# EAGLE design BeeBeeAte-RemoteBoard (EAGLE 9.6.2)

## Sheet 1 of 3: ESP-32 mit USB Schnitstelle und Joystick
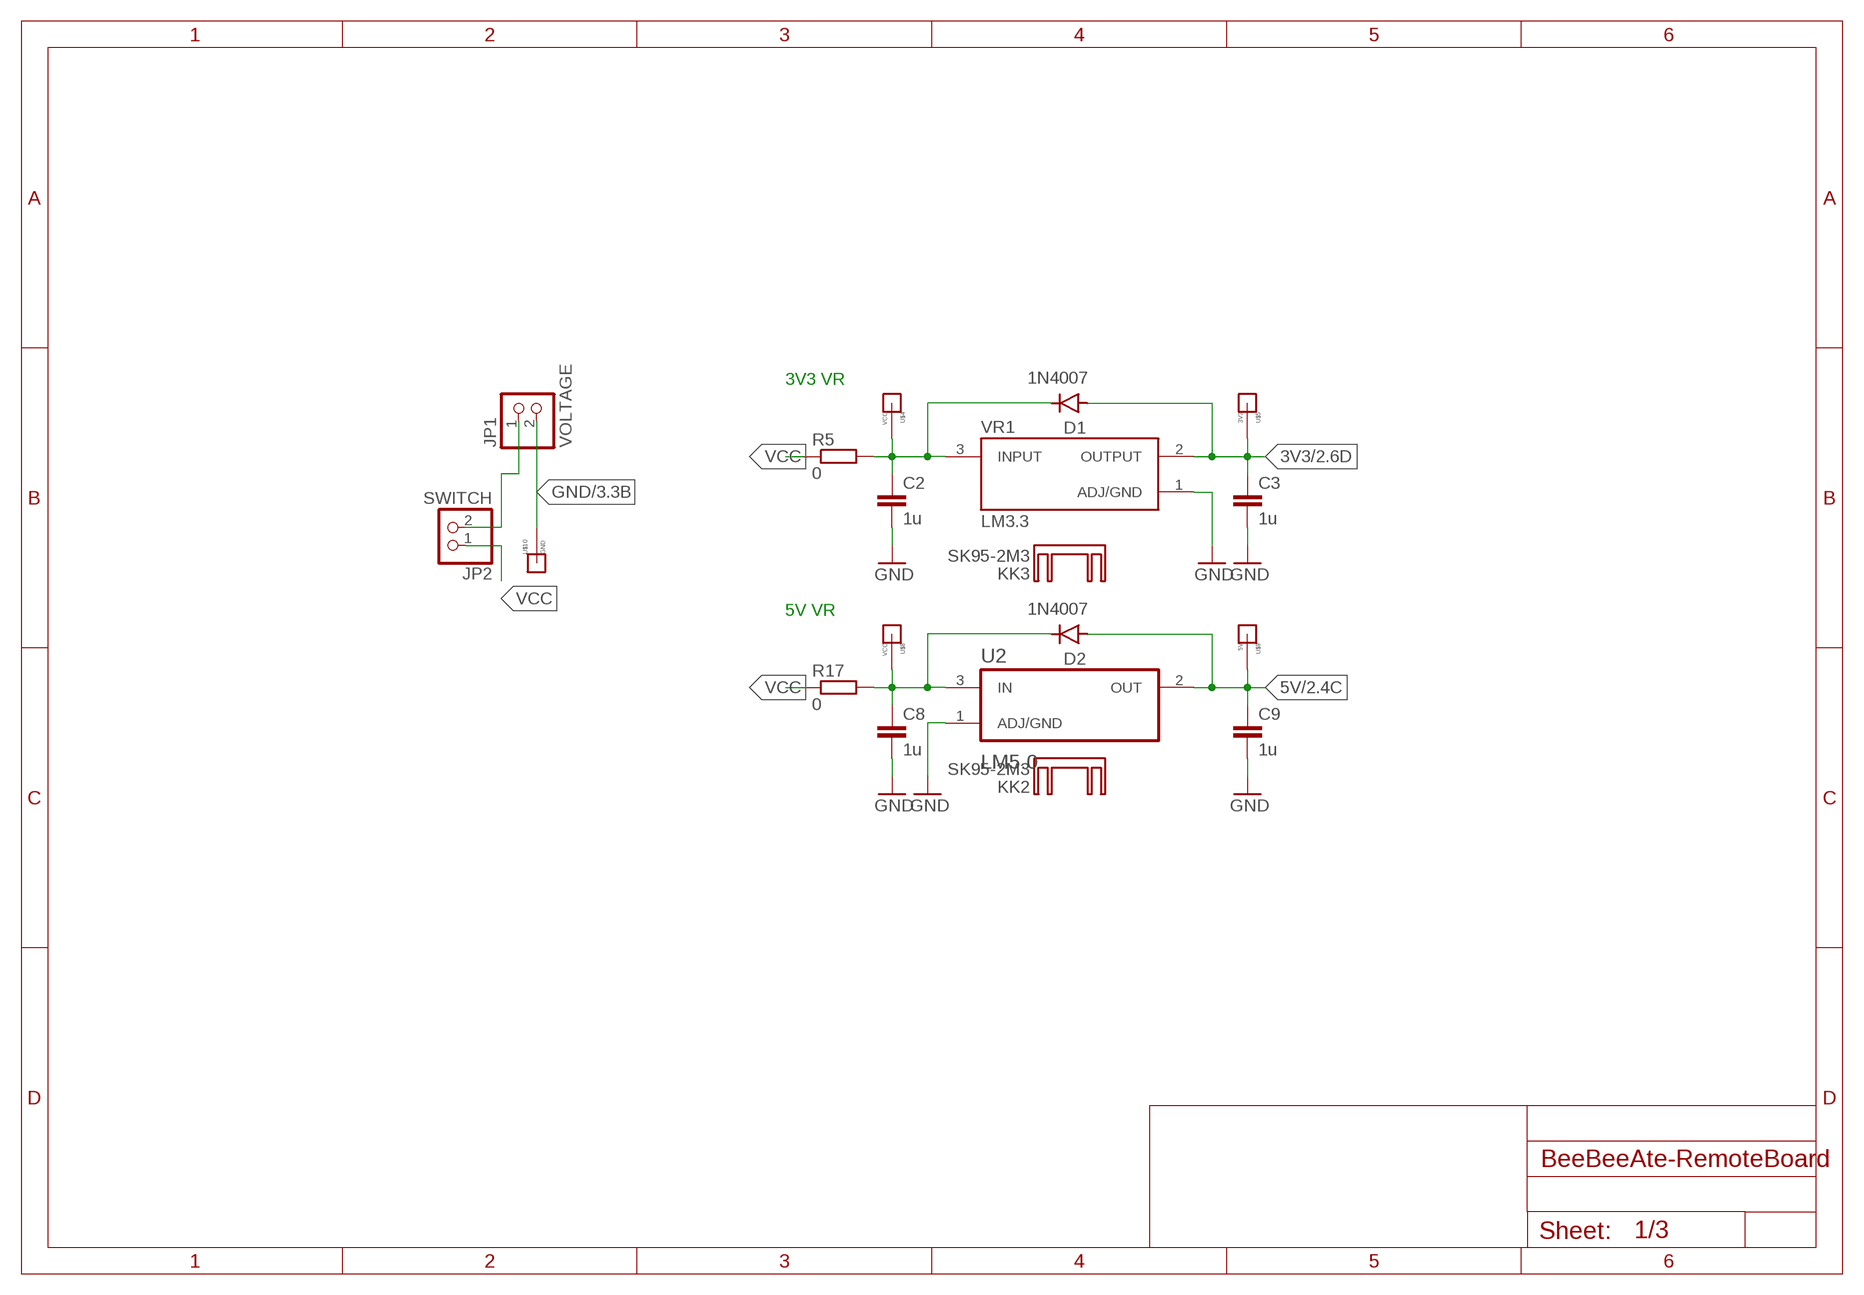
[diagram p0: schematic, sheet 1]

### Parts
C2  1u  C-EUC0805  [C0805]
C3  1u  C-EUC0805  [C0805]
C8  1u  C-EUC0805  [C0805]
C9  1u  C-EUC0805  [C0805]
D1  1N4007  [DO-41]
D2  1N4007  [DO-41]
JP1  VOLTAGE  PINHD-1X2  [1X02]
JP2  SWITCH  PINHD-1X2  [1X02]
KK2  SK95-2M3  [SK95-2M3]
KK3  SK95-2M3  [SK95-2M3]
R5  0  R-EU_R0805  [R0805]
R17  0  R-EU_R0805  [R0805]
U2  LM5.0  LM1117T-5.0  [TO254P1054X470X1955-3]
U$4  VCC  MESSPAD  [MESSPAD]
U$5  3V3  MESSPAD  [MESSPAD]
U$8  VCC  MESSPAD  [MESSPAD]
U$9  5V  MESSPAD  [MESSPAD]
U$10  GND  MESSPAD  [MESSPAD]
VR1  LM3.3  LM1117T-3.3/NOPB  [TO254P1054X470X1955-3]

### Nets
3V3: C3.1 D1.A U$5.MSP VR1.2(OUTPUT) ; also sheet 2,3
5V: C9.1 D2.A U2.2(OUT) U$9.MSP ; also sheet 2
GND: C2.2 C3.2 C8.2 C9.2 JP1.2 U2.1(ADJ/GND) U$10.MSP VR1.1(ADJ/GND) ; also sheet 2,3
N$3: C8.1 D2.C R17.2 U2.3(IN) U$8.MSP
N$4: C2.1 D1.C R5.2 U$4.MSP VR1.3(INPUT)
N$5: JP1.1 JP2.2
VCC: JP2.1 R5.1 R17.1

### Notes on the sheet
- 3V3 VR
- 5V VR

## Sheet 2 of 3: ESP 32
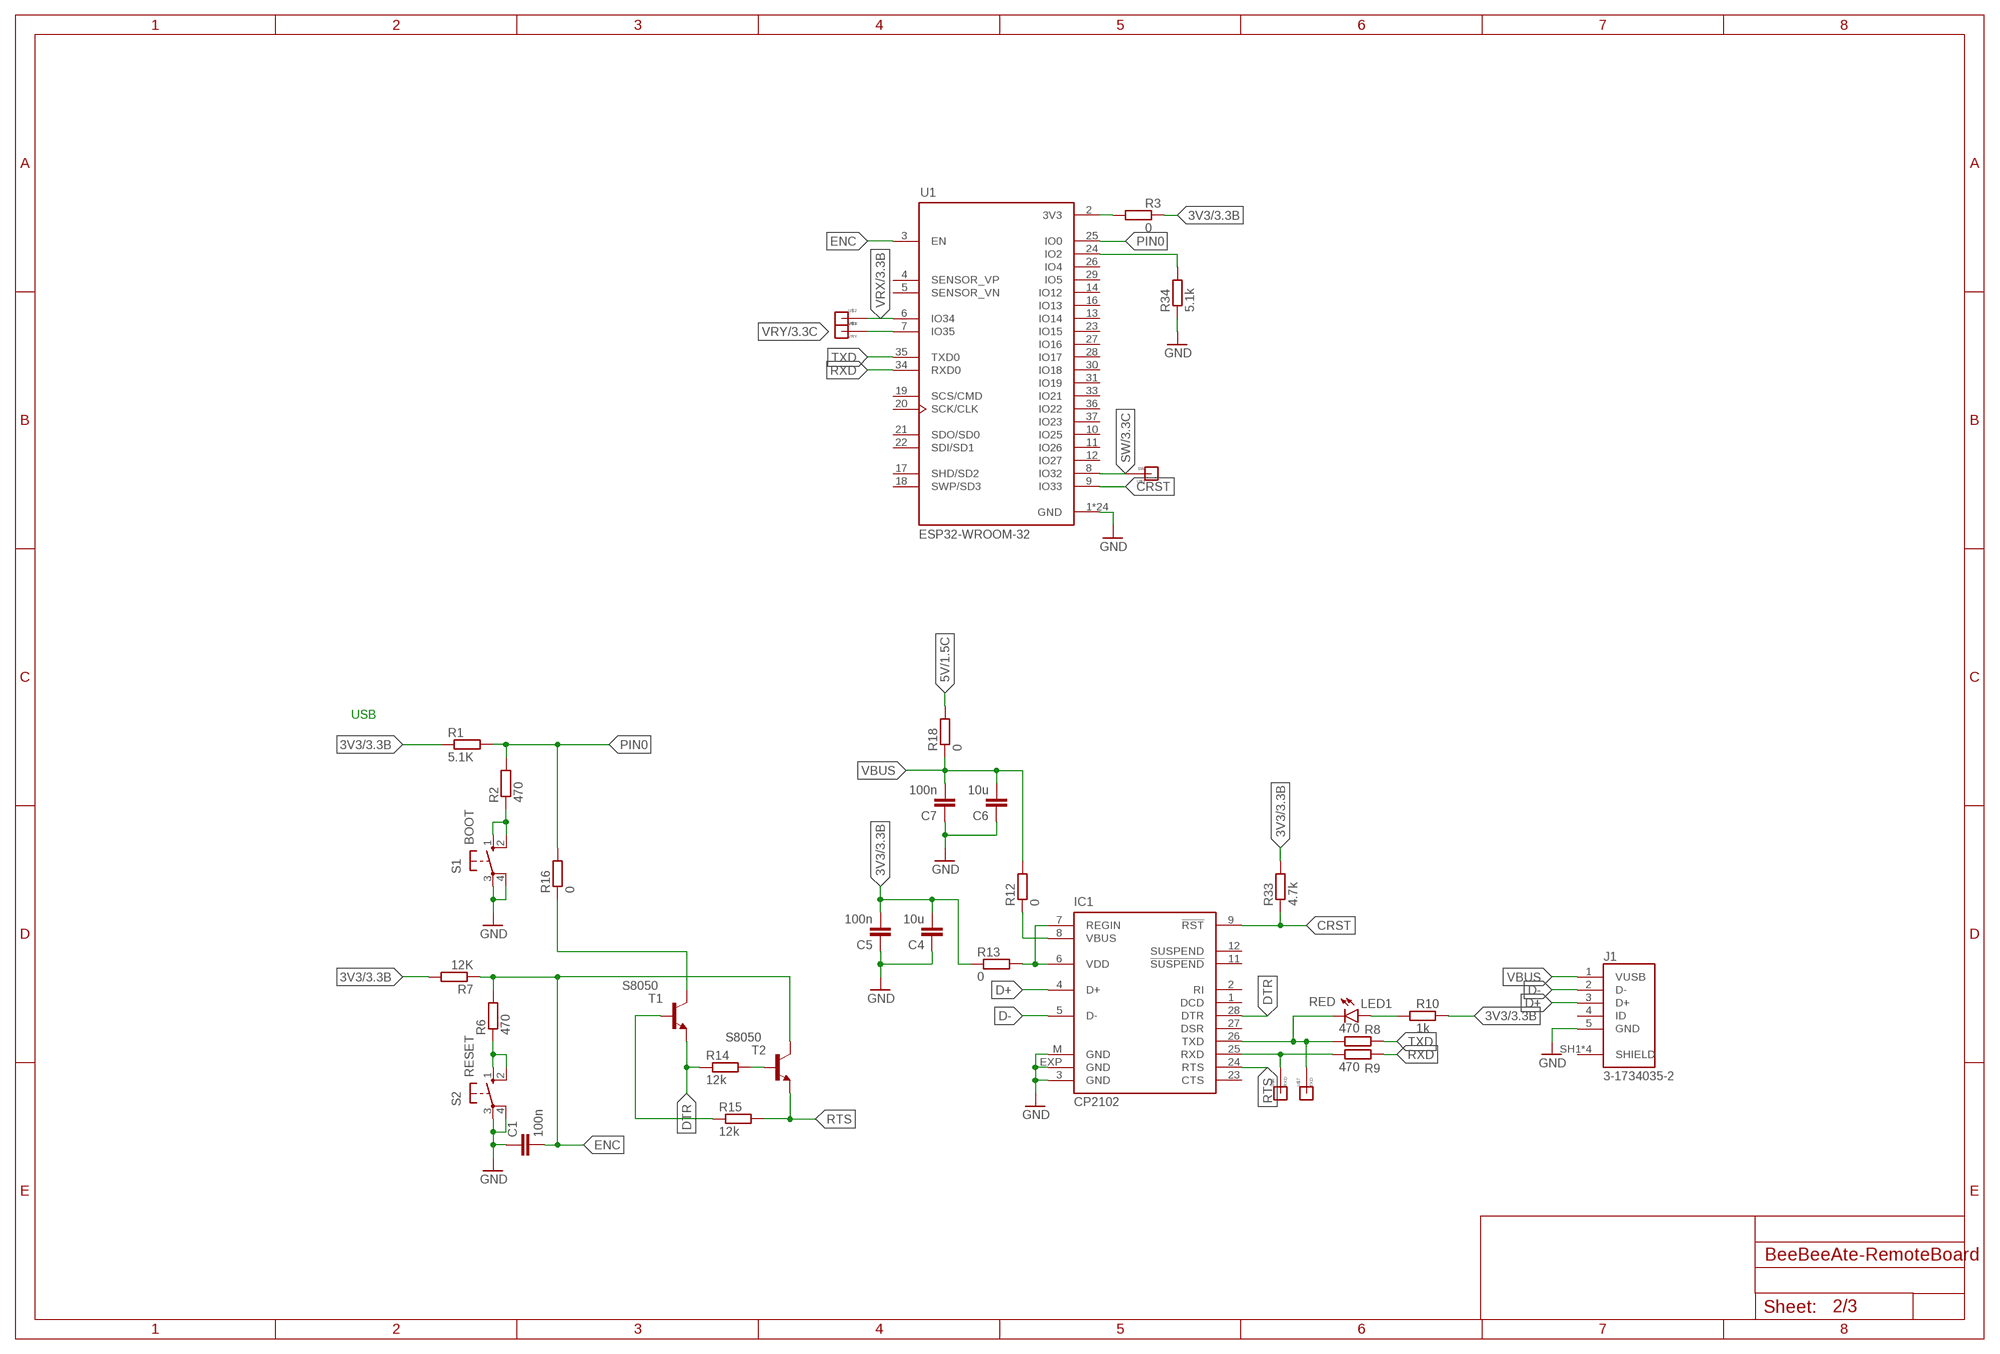
[diagram p1: schematic, sheet 2]

### Parts
C1  100n  C-EUC0805  [C0805]
C4  10u  C-EUC0805  [C0805]
C5  100n  C-EUC0805  [C0805]
C6  10u  C-EUC0805  [C0805]
C7  100n  C-EUC0805  [C0805]
IC1  CP2102  [MLP28]
J1  3-1734035-2  [TE_3-1734035-2]
LED1  RED  LEDCHIP-LED0805  [CHIP-LED0805]
R1  5.1K  R-EU_R0805  [R0805]
R2  470  R-EU_R0805  [R0805]
R3  0  R-EU_R0805  [R0805]
R6  470  R-EU_R0805  [R0805]
R7  12K  R-EU_R0805  [R0805]
R8  470  R-EU_R0805  [R0805]
R9  470  R-EU_R0805  [R0805]
R10  1k  R-EU_R0805  [R0805]
R12  0  R-EU_R0805  [R0805]
R13  0  R-EU_R0805  [R0805]
R14  12k  R-EU_R0805  [R0805]
R15  12k  R-EU_R0805  [R0805]
R16  0  R-EU_R0805  [R0805]
R18  0  R-EU_R0805  [R0805]
R33  4.7k  R-EU_R0805  [R0805]
R34  5.1k  R-EU_R0805  [R0805]
S1  BOOT  10-XX  [B3F-10XX]
S2  RESET  10-XX  [B3F-10XX]
T1  S8050  BC808-NPN-SOT23-BEC  [SOT23-BEC]
T2  S8050  BC808-NPN-SOT23-BEC  [SOT23-BEC]
U1  ESP32-WROOM-32  [MODULE_ESP32-WROOM-32]
U$1  VRY  MESSPAD  [MESSPAD]
U$2  VRX  MESSPAD  [MESSPAD]
U$3  SW  MESSPAD  [MESSPAD]
U$6  RXD  MESSPAD  [MESSPAD]
U$7  TXD  MESSPAD  [MESSPAD]

### Nets
3V3: C4.2 C5.2 R1.1 R3.2 R7.2 R10.2 R13.1 R33.2 ; also sheet 1,3
5V: R18.2 ; also sheet 1
CRST: IC1.9(!RST) R33.1 U1.9(IO33)
D+: IC1.4(D+) J1.3(D+)
D-: IC1.5(D-) J1.2(D-)
DTR: IC1.28(DTR) R14.1 T1.E
ENC: C1.2 R6.2 R7.1 T2.C U1.3(EN)
GND: C1.1 C4.1 C5.1 C6.1 C7.1 IC1.3(GND) IC1.EXP(GND) IC1.M(GND) J1.5(GND) R34.1 S1.3(P) S1.4(P1) S2.3(P) S2.4(P1) U1.1(GND) U1.15(GND) U1.38(GND) U1.39_1(GND) U1.39_2(GND) U1.39_3(GND) U1.39_4(GND) U1.39_5(GND) U1.39_6(GND) U1.39_7(GND) U1.39_8(GND) U1.39_9(GND) U1.39_10(GND) U1.39_11(GND) U1.39_12(GND) U1.39_13(GND) U1.39_14(GND) U1.39_15(GND) U1.39_16(GND) U1.39_17(GND) U1.39_18(GND) U1.39_19(GND) U1.39_20(GND) U1.39_21(GND) ; also sheet 1,3
N$1: R2.1 S1.1(S) S1.2(S1)
N$2: R6.1 S2.1(S) S2.2(S1)
N$6: IC1.25(RXD) R9.1 U$6.MSP
N$7: LED1.A R10.1
N$9: IC1.26(TXD) LED1.C R8.1 U$7.MSP
N$10: IC1.6(VDD) IC1.7(REGIN) R13.2
N$11: IC1.8(VBUS) R12.1
N$12: R14.2 T2.B
N$14: R15.1 T1.B
N$15: R3.1 U1.2(3V3)
N$25: R34.2 U1.24(IO2)
PIN0: R1.2 R2.2 R16.2 U1.25(IO0)
PIN1: R16.1 T1.C
RTS: IC1.24(RTS) R15.2 T2.E
RXD: R9.2 U1.34(RXD0)
SW: U1.8(IO32) U$3.MSP ; also sheet 3
TXD: R8.2 U1.35(TXD0)
VBUS: C6.2 C7.2 J1.1(VUSB) R12.2 R18.1
VRX: U1.6(IO34) U$2.MSP ; also sheet 3
VRY: U1.7(IO35) U$1.MSP ; also sheet 3
Unconnected: IC1.1(DCD) IC1.2(RI) IC1.11(!SUSPEND) IC1.12(SUSPEND) IC1.23(CTS) IC1.27(DSR) J1.4(ID) J1.SH1(SHIELD) J1.SH2(SHIELD) J1.SH3(SHIELD) J1.SH4(SHIELD) U1.4(SENSOR_VP) U1.5(SENSOR_VN) U1.10(IO25) U1.11(IO26) U1.12(IO27) U1.13(IO14) U1.14(IO12) U1.16(IO13) U1.17(SHD/SD2) U1.18(SWP/SD3) U1.19(SCS/CMD) U1.20(SCK/CLK) U1.21(SDO/SD0) U1.22(SDI/SD1) U1.23(IO15) U1.26(IO4) U1.27(IO16) U1.28(IO17) U1.29(IO5) U1.30(IO18) U1.31(IO19) U1.33(IO21) U1.36(IO22) U1.37(IO23)

### Notes on the sheet
- USB

## Sheet 3 of 3: Joystick
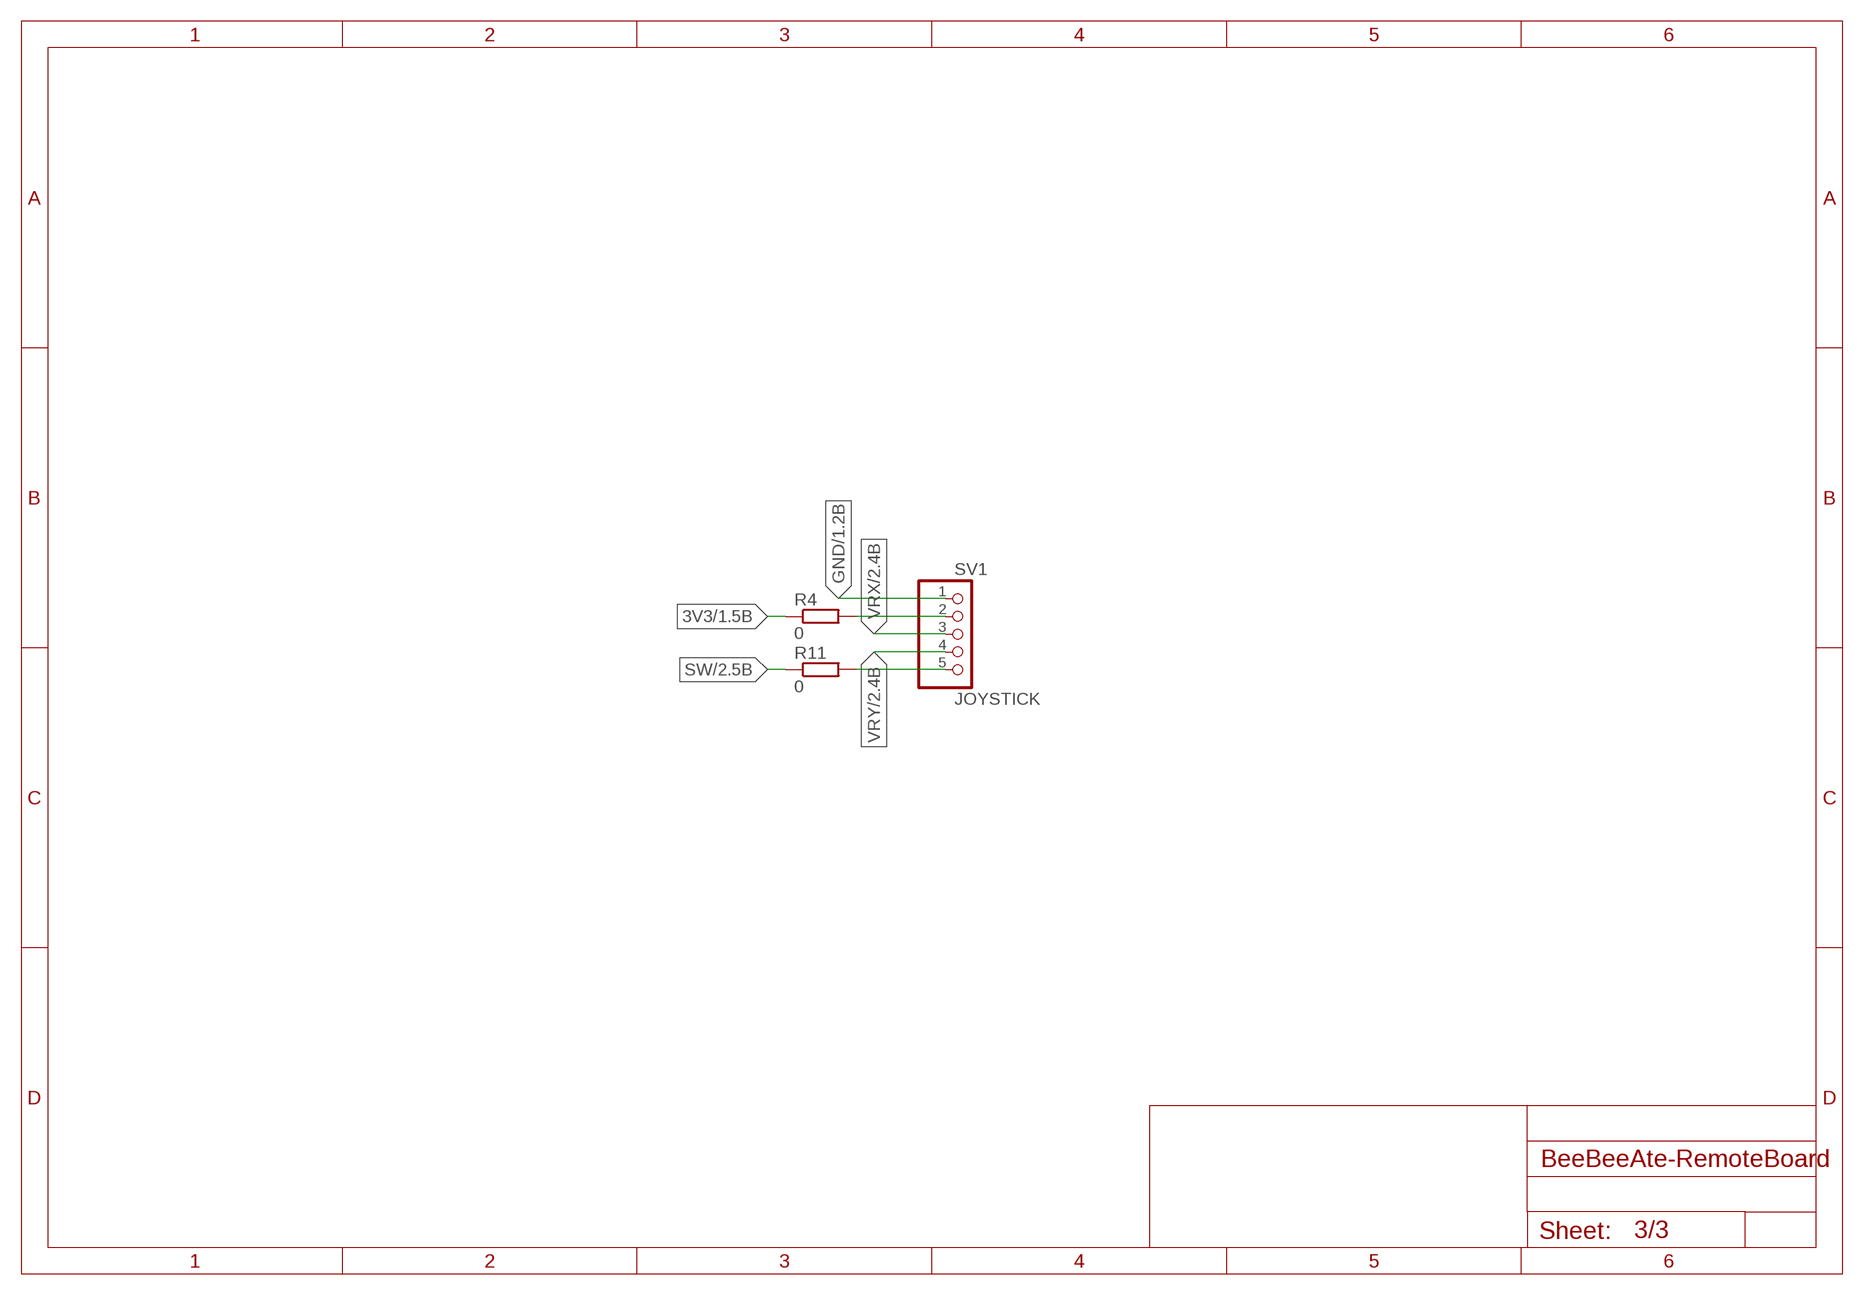
[diagram p2: schematic, sheet 3]

### Parts
R4  0  R-EU_R0805  [R0805]
R11  0  R-EU_R0805  [R0805]
SV1  JOYSTICK  PINHD-1X5/90  [1X05/90]

### Nets
3V3: R4.1 ; also sheet 1,2
GND: SV1.1 ; also sheet 1,2
N$8: R4.2 SV1.2
N$13: R11.2 SV1.5
SW: R11.1 ; also sheet 2
VRX: SV1.3 ; also sheet 2
VRY: SV1.4 ; also sheet 2

## Library data of the parts
C1-C9 = rcl:C-EU: CAPACITOR, European symbol; SPICEPREFIX: C
D1 D2 = Diodes:1N4007: DIODE GEN PURP 1KV 1A DO41 Manufacturer's datasheet <https://www.mccsemi.com/pdf/Products/1N4001-1N4007(DO-41).pdf>; CREATED_BY: PCBLayout.com; DIGIKEY_PART_NUMBER: 1N4007MSCT-ND; MANUFACTURER: Micro Commercial Co; MPN: 1N4007; PACKAGE: DO-41
IC1 = silabs:CP210*: Single-Chip USB to UART Bridge Source: www.silabs.com .. CP2101.pdf / cp2102.pdf; MF: FARNELL; MPN: CP2102-GM; OC_FARNELL: 9282130; OC_NEWARK: 30K5635
J1 = 3-1734035-2:3-1734035-2: USB Connectors MINI USB, R/A, SMT, MATTE TIN, W/O MYLAR Check prices <https://pricing.snapeda.com/parts/3-1734035-2/TE%20Connectivity/view-part?ref=eda>; AVAILABILITY: In Stock; COMMENT: 3-1734035-2; DESCRIPTION: USB Connectors MINI USB, R/A, SMT, MATTE TIN, W/O MYLAR; MF: TE Connectivity; MP: 3-1734035-2; PACKAGE: None; PRICE: None; PURCHASE-URL: https://pricing.snapeda.com/search/part/3-1734035-2/?ref=eda
JP1 JP2 = pinhead:PINHD-1X2: PIN HEADER
KK2 KK3 = heatsink:SK95-2M3: HEATSINK manufacturer Fischer/distributor Buerklin
LED1 = led:LED: LED OSRAM: - CHIPLED LG R971, LG N971, LY N971, LG Q971, LY Q971, LO R971, LY R971 LH N974, LH R974 LS Q976, LO Q976, LY Q976 LO Q996 - Hyper CHIPLED LW Q18S LB Q993, LB Q99A, LB R99A - SideLED LS A670, LO A670, LY A670, LG A670, LP A670 LB A673, LV A673, LT A673, LW A673 LH A674 LY A675 LS A676, LA A676, LO A676, LY A676, LW A676 LS A679, LY A679, LG A679 - Hyper Micro SIDELED® LS Y876, LA Y876, LO Y876, LY Y876 LT Y87S - SmartLED LW L88C, LW L88S LB L89C, LB L89S, LG L890 LS L89K, LO L89K, LY L89K LS L896, LA L896, LO L896, LY L896 - TOPLED LS T670, LO T670, LY T670, LG T670, LP T670 LSG T670, LSP T670, LSY T670, LOP T670, LYG T670 LG T671, LOG T671, LSG T671 LB T673, LV T673, LT T673, LW T673 LH T674 LS T676, LA T676, LO T676, LY T676, LB T676, LH T676, LSB T676, LW T676 LB T67C, LV T67C, LT T67C, LS T67K, LO T67K, LY T67K, LW E67C LS E67B, LA E67B, LO E67B, LY E67B, LB E67C, LV E67C, LT E67C LW T67C LS T679, LY T679, LG T679 LS T770, LO T770, LY T770, LG T770, LP T770 LB T773, LV T773, LT T773, LW T773 LH T774 LS E675, LA E675, LY E675, LS T675 LS T776, LA T776, LO T776, LY T776, LB T776 LHGB T686 LT T68C, LB T68C - Hyper Mini TOPLED® LB M676 - Mini TOPLED Santana® LG M470 LS M47K, LO M47K, LY M47K Source: http://www.osram.convergy.de LUXEON: - LUMILED® LXK2-PW12-R00, LXK2-PW12-S00, LXK2-PW14-U00, LXK2-PW14-V00 LXK2-PM12-R00, LXK2-PM12-S00, LXK2-PM14-U00 LXK2-PE12-Q00, LXK2-PE12-R00, LXK2-PE12-S00, LXK2-PE14-T00, LXK2-PE14-U00 LXK2-PB12-K00, LXK2-PB12-L00, LXK2-PB12-M00, LXK2-PB14-N00, LXK2-PB14-P00, LXK2-PB14-Q00 LXK2-PR12-L00, LXK2-PR12-M00, LXK2-PR14-Q00, LXK2-PR14-R00 LXK2-PD12-Q00, LXK2-PD12-R00, LXK2-PD12-S00 LXK2-PH12-R00, LXK2-PH12-S00 LXK2-PL12-P00, LXK2-PL12-Q00, LXK2-PL12-R00 Source: www.luxeon.com KINGBRIGHT: KA-3528ASYC Source: www.kingbright.com
R1-R18 R33 R34 = rcl:R-EU_: RESISTOR, European symbol; SPICEPREFIX: R
S1 S2 = switch-omron:10-XX: OMRON SWITCH; MPN: B3F-1000; OC_FARNELL: 176432; OC_NEWARK: 36M3542
SV1 = pinhead:PINHD-1X5: PIN HEADER
T1 T2 = transistor:*-NPN-: NPN Transistror BF959 corrected 2008.03.06
U1 = ESP32-WROOM-32:ESP32-WROOM-32: Bluetooth, WiFi Transceiver Module 2.4GHz ~ 2.5GHz Surface Mount Check prices <https://pricing.snapeda.com/parts/ESP32-WROOM-32/Espressif%20Systems/view-part?ref=eda>; AVAILABILITY: In Stock; DESCRIPTION: Bluetooth, WiFi 802.11b/g/n, Bluetooth v4.2 +EDR, Class 1, 2 and 3 Transceiver Module 2.4GHz ~ 2.5GHz Antenna Not Included, U.FL Surface Mount; MF: Espressif Systems; MP: ESP32-WROOM-32; PACKAGE: Module Espressif Systems; PRICE: None; PURCHASE-URL: https://pricing.snapeda.com/search/part/ESP32-WROOM-32/?ref=eda
U2 = LM1117T-5.0:LM1117T-5.0: Check prices <https://pricing.snapeda.com/parts/LM1117T-5.0/NOPB/Texas%20Instruments/view-part?ref=eda>; AVAILABILITY: In Stock; DESCRIPTION: 800-mA 15-V linear voltage regulator 3-TO-220 0 to 125; MF: Texas Instruments; MP: LM1117T-5.0/NOPB; PACKAGE: TO-220-3 Texas Instruments; PRICE: None; PURCHASE-URL: https://pricing.snapeda.com/search/part/LM1117T-5.0/NOPB/?ref=eda
U$1-U$10 = 03lanfra-PADS:MESSPAD
VR1 = LM1117T-3.3:LM1117T-3.3/NOPB: Check prices <https://pricing.snapeda.com/parts/LM1117T-3.3/NOPB/Texas%20Instruments/view-part?ref=eda>; AVAILABILITY: In Stock; DESCRIPTION: 800-mA 15-V linear voltage regulator 3-TO-220 0 to 125; MF: Texas Instruments; MP: LM1117T-3.3/NOPB; PACKAGE: TO-220-3 Texas Instruments; PRICE: None; PURCHASE-URL: https://pricing.snapeda.com/search/part/LM1117T-3.3/NOPB/?ref=eda

## Board
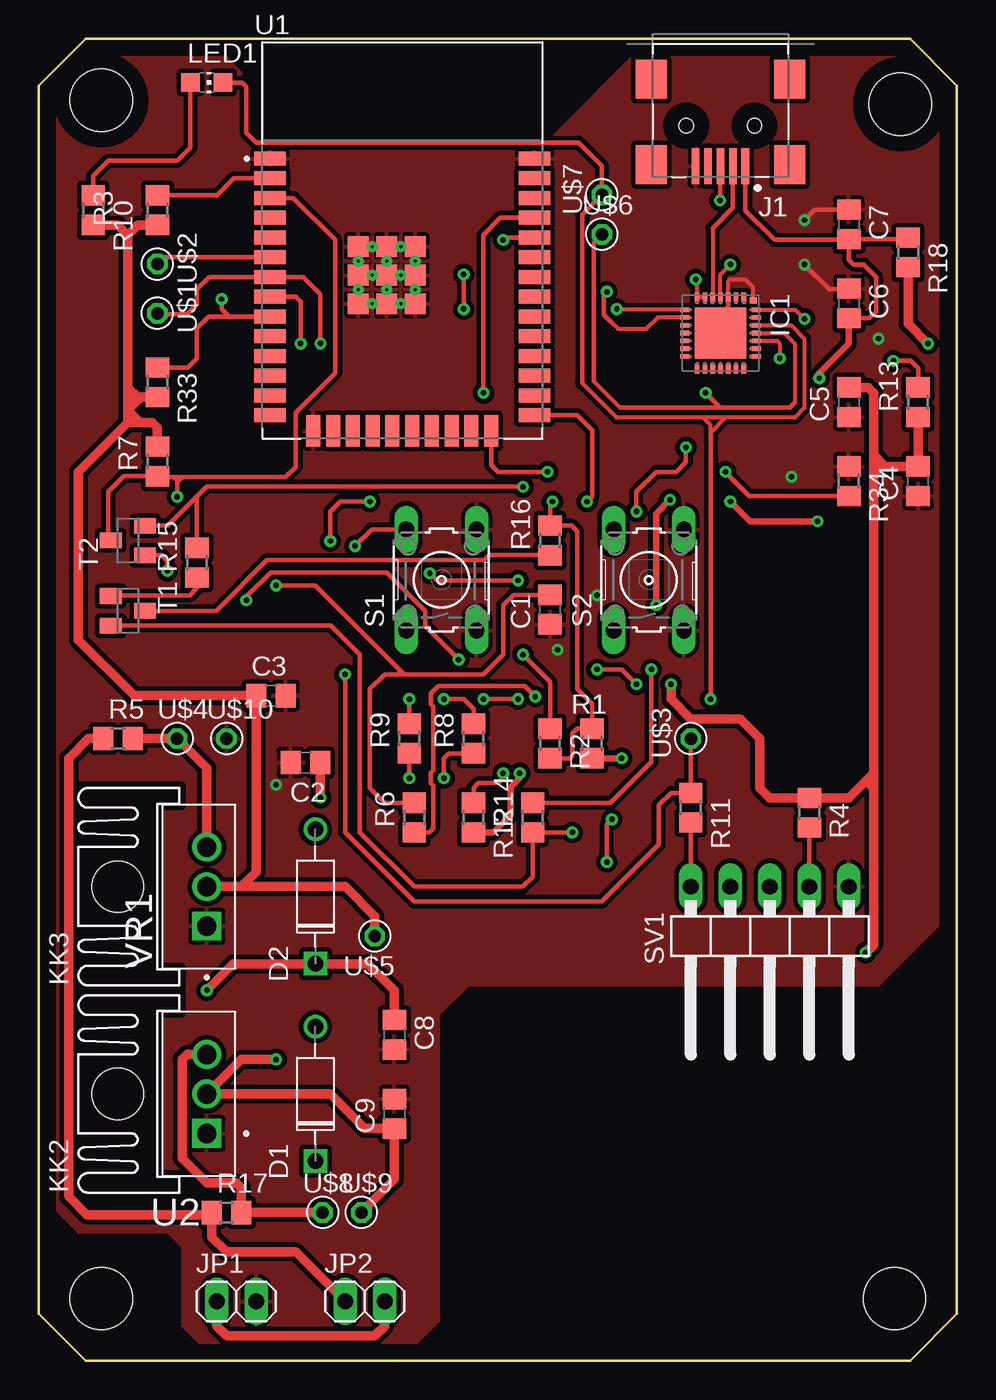
[diagram p3: board, top side]
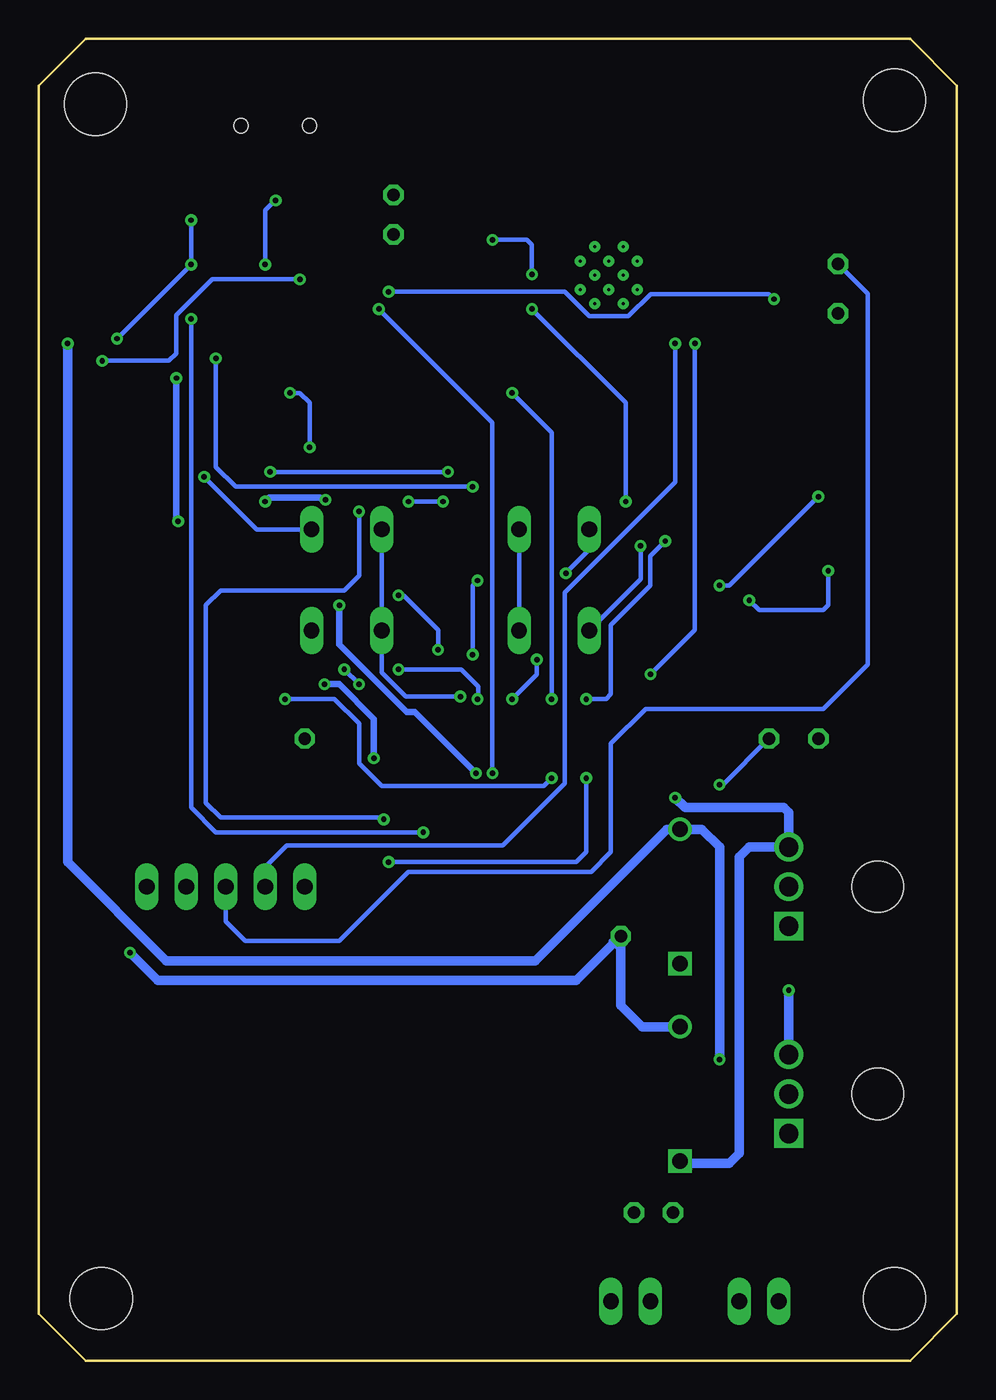
[diagram p4: board, bottom side, seen from below]

Size 59 x 85 mm. Coordinates in mm from the lower left corner, seen from the top.
Outline: 0,3 3,0 56,0 59,3 59,82 56,85 3,85 0,82 0,3
Copper layers (1*16): Top 0.035mm / dielectric 1.5mm / Bottom 0.035mm
Design rules "default *": minimum track width 6mil, minimum drill 0.35mm, track to track 12mil, track to pad 12mil, pad to pad 12mil, via to via 12mil, smd to smd 12mil, copper to edge 40mil, drill to drill 12mil, minimum pad ring 10mil, minimum via ring 8mil, stop-mask expansion 4mil, vias tented up to drill 0mil, thermal gap 10mil
Holes 4 mm at 4,81.05 55.37,80.8 55,4 4,4

### Footprints (pad centres in the part's own frame; a part is rotated, then mirrored left to right if it is on the bottom)
C0805 = smd 1.3 x 1.5: 1 -0.95,0; 2 0.95,0
DO-41 = drill 1: A 4.325,0 | drill 1 square: C -4.325,0
MLP28 = smd 0.6 x 0.3: 1 -2.3,1.5; 2 -2.3,1; 3 -2.3,0.5; 4 -2.3,0; 5 -2.3,-0.5; 6 -2.3,-1; 7 -2.3,-1.5; 15 2.3,-1.5; 16 2.3,-1; 17 2.3,-0.5; 18 2.3,0; 19 2.3,0.5; 20 2.3,1; 21 2.3,1.5 | smd 0.3 x 0.6: 8 -1.5,-2.3; 9 -1,-2.3; 10 -0.5,-2.3; 11 0,-2.3; 12 0.5,-2.3; 13 1,-2.3; 14 1.5,-2.3; 22 1.5,2.3; 23 1,2.3; 24 0.5,2.3; 25 0,2.3; 26 -0.5,2.3; 27 -1,2.3; 28 -1.5,2.3 | smd 3.3 x 3.3: EXP 0,0 | smd 0.435 x 0.435: M -2.103,2.103
TE_3-1734035-2 = smd 0.5 x 2.3: 1 -1.6,2.6; 2 -0.8,2.6; 3 0,2.6; 4 0.8,2.6; 5 1.6,2.6 | smd 2 x 2.5: SH1 -4.45,2.5; SH2 4.45,2.5; SH3 -4.45,-3; SH4 4.45,-3 | hole 0.9: -2.2,0; 2.2,0
1X02 = drill 1.016 long: 1 -1.27,0; 2 1.27,0
SK95-2M3 = hole 3.302: 0,2.54
CHIP-LED0805 = smd 1.2 x 1.2: A 0,-1.05; C 0,1.05
R0805 = smd 1.3 x 1.5: 1 -0.95,0; 2 0.95,0
B3F-10XX = drill 1.016 long: 1 -3.251,2.261; 2 3.251,2.261; 3 -3.251,-2.261; 4 3.251,-2.261
1X05/90 = drill 1.016 long: 1 -5.08,-3.81; 2 -2.54,-3.81; 3 0,-3.81; 4 2.54,-3.81; 5 5.08,-3.81
SOT23-BEC = smd 1 x 1.4: B -0.95,-1.1; C 0,1.1; E 0.95,-1.1
MODULE_ESP32-WROOM-32 = smd 2 x 0.9: 1 -8.5,5.26; 2 -8.5,3.99; 3 -8.5,2.72; 4 -8.5,1.45; 5 -8.5,0.18; 6 -8.5,-1.09; 7 -8.5,-2.36; 8 -8.5,-3.63; 9 -8.5,-4.9; 10 -8.5,-6.17; 11 -8.5,-7.44; 12 -8.5,-8.71; 13 -8.5,-9.98; 14 -8.5,-11.25; 25 8.5,-11.25; 26 8.5,-9.98; 27 8.5,-8.71; 28 8.5,-7.44; 29 8.5,-6.17; 30 8.5,-4.9; 31 8.5,-3.63; 32 8.5,-2.36; 33 8.5,-1.09; 34 8.5,0.18; 35 8.5,1.45; 36 8.5,2.72; 37 8.5,3.99; 38 8.5,5.26 | smd 0.9 x 2: 15 -5.715,-12.25; 16 -4.445,-12.25; 17 -3.175,-12.25; 18 -1.905,-12.25; 19 -0.635,-12.25; 20 0.635,-12.25; 21 1.905,-12.25; 22 3.175,-12.25; 23 4.445,-12.25; 24 5.715,-12.25 | smd 1.33 x 1.33: 39_1 -2.835,-0.405; 39_2 -1,-0.405; 39_3 0.835,-0.405; 39_4 -2.835,-2.24; 39_5 -1,-2.24; 39_6 0.835,-2.24; 39_7 -2.835,-4.075; 39_8 -1,-4.075; 39_9 0.835,-4.075 | drill 0.2 pad 0.3: 39_10 -1.917,-0.405; 39_11 -0.083,-0.405; 39_12 -2.835,-1.323; 39_13 -1,-1.323; 39_14 0.835,-1.323; 39_15 -1.917,-2.24; 39_16 -0.083,-2.24; 39_17 -2.835,-3.158; 39_18 -1,-3.158; 39_19 0.835,-3.158; 39_20 -1.917,-4.075; 39_21 -0.083,-4.075
TO254P1054X470X1955-3 = drill 1.24 square: 1 -2.54,0 | drill 1.24: 2 0,0; 3 2.54,0
MESSPAD = drill 0.8 octagon: MSP 0,0

### Placement (x,y rotation side)
C1  32.86,48.3 90 top
C2  17.14,38.47 180 top
C3  14.92,42.77 0 top
C4  56.52,56.55 90 top
C5  52.07,61.63 90 top
C6  52.07,67.98 270 top
C7  52.07,73.06 270 top
C8  22.86,20.95 270 top
C9  22.86,15.88 90 top
D1  17.78,17.14 90 top
D2  17.78,29.84 90 top
IC1  43.81,66.08 270 top
J1  43.81,79.42 180 top
JP1  12.7,3.81 0 top
JP2  20.95,3.81 0 top
KK2  7.62,17.14 90 top
KK3  7.62,30.48 90 top
LED1  10.79,82.19 270 top
R1  35.56,39.69 90 top
R2  32.86,39.69 270 top
R3  7.62,73.98 270 top
R4  49.53,35.24 270 top
R5  5.08,40.01 0 top
R6  24.13,34.92 90 top
R7  7.62,57.83 90 top
R8  27.94,40.01 90 top
R9  23.81,40.01 90 top
R10  3.49,73.98 270 top
R11  41.91,35.56 270 top
R12  27.94,34.92 270 top
R13  56.52,61.63 90 top
R14  31.75,34.92 90 top
R15  10.16,51.32 90 top
R16  32.86,52.74 90 top
R17  12.06,9.53 0 top
R18  55.88,71.27 270 top
R33  7.62,62.91 270 top
R34  52.07,56.55 270 top
S1  25.88,50.2 90 top
S2  39.21,50.2 90 top
SV1  46.99,26.67 180 top
T1  5.71,48.22 270 top
T2  5.71,52.74 90 top
U1  23.36,72.04 0 top
U2  10.79,17.14 90 top
U$1  7.62,67.35 0 top
U$2  7.62,70.53 0 top
U$3  41.91,40.01 90 top
U$4  8.89,40.01 0 top
U$5  21.59,27.3 180 top
U$6  36.2,72.43 0 top
U$7  36.2,74.97 0 top
U$8  18.24,9.53 0 top
U$9  20.73,9.53 0 top
U$10  12.06,40.01 0 top
VR1  10.79,30.48 90 top

### Tracks (layer width: path | path; a pad name or v marks a point on that pad's centre or on a via)
3V3  (via drill 0.35)
  Top 0.305: 13.02,30.48 VR1.2 | R4.1 | R1.1
  Top 0.406: v37.47,38.73 R1.1 | 53.66,36.67 53.18,37.15 53.18,37.31
  Top 0.61: 5.71,62.55 6.31,61.95 | 6.31,61.95 6.43,61.83 5.71,61.12 | 6.31,61.95 R33.2 | 5.71,62.55 5.71,61.12 | 5.71,61.12 5.71,60.33 | 13.02,30.48 13.97,31.43 C3.1 | VR1.2 19.68,30.48 21.59,28.57 U$5.MSP | 53.66,58.26 53.66,62.23 53.3,62.59 C5.2 | 53.66,58.26 53.66,56.99 | 53.66,56.99 53.66,37.78 | R4.1 52.07,36.19 53.18,37.31 53.66,37.78 | R4.1 46.99,36.2 46.35,36.83 46.35,40.01 45.09,41.27 41.91,41.27 40.64,42.55 v40.64,43.5 | 5.71,60.33 2.54,57.15 2.54,46.35 6.13,42.77 C3.1 | 53.66,37.78 53.66,36.67 53.66,26.75 v53.15,26.24 | 5.71,60.33 6.51,60.33 | 6.51,60.33 7.3,60.33 7.62,60.01 R7.2 | R13.1 C4.2 54.41,57.51 | 6.51,60.33 5.71,61.12 | 54.41,57.51 53.66,58.26 | 54.41,57.51 54.17,57.51 | 54.13,57.47 53.66,56.99 | C3.1 | 5.71,72.39 5.71,62.55 | R10.2 5.07,73.03 5.71,72.39 | R3.2 6.36,73.03 5.71,72.39
  Bottom 0.305: 22.23,26.99 21.59,26.35 21.59,25.72
  Bottom 0.406: v40.64,43.5 39.69,43.5 37.47,41.27 v37.47,38.73
  Bottom 0.61: D1.A 20.2,21.47 21.59,22.86 21.59,25.72 U$5.MSP 24.45,24.45 51.36,24.45 v53.15,26.24
5V  (via drill 0.35)
  Top 0.305: C9.1
  Top 0.61: C9.1 20.95,14.92 18.73,17.14 U2.2 13.02,19.37 v15.24,19.37 | C9.1 22.86,11.65 U$9.MSP | v57.15,65.41 55.88,66.67 R18.2
  Bottom 0.61: v15.24,19.37 15.24,33.02 16.39,34.17 D2.A 18.62,34.17 27.08,25.72 50.8,25.72 57.15,32.07 v57.15,65.41
CRST  (via drill 0.35)
  Top 0.254: IC1.9 39.77,67.08 39.05,66.36 37.24,66.36 36.8,66.79
  Top 0.305: 36.8,66.79 36.31,67.28 36.31,68.54 v36.51,68.74 | v11.75,68.26 11.75,67.63 12.23,67.14 | R33.1 9.56,63.85 10.16,64.45 10.16,66.39 10.9,67.14 12.23,67.14 | U1.9 12.23,67.14
  Bottom 0.305: v36.51,68.74 25.2,68.74 23.61,67.15 21.11,67.15 19.68,68.58 12.06,68.58 v11.75,68.26
D+  (via drill 0.35)
  Top 0.254: IC1.4 43.81,69.85 v44.45,70.48
  Top 0.305: J1.3 43.81,74.65 v43.78,74.61
  Bottom 0.305: v44.45,70.48 44.45,73.98 43.81,74.61 v43.78,74.61
D-
  Top 0.254: 43.31,72.84 IC1.5
  Top 0.305: J1.2 44.62,74.14 43.31,72.84
DTR  (via drill 0.35)
  Top 0.254: IC1.28 48.62,67.58 v49.21,66.99
  Top 0.305: v34.29,33.97 R14.1 31.75,31.11 31.11,30.48 24.13,30.48 20.64,33.97 20.64,45.4 18.78,47.26 5.93,47.26 5.92,47.27 T1.E
  Bottom 0.305: v49.21,66.99 49.21,35.56 47.62,33.97 v34.29,33.97
ENC  (via drill 0.35)
  Top 0.305: T2.C 4.45,52.91 4.45,55.88 5.44,56.88 R7.1 7.69,56.81 8.67,56.81 | 23.18,44.13 22.23,44.13 21.27,43.18 21.27,36.83 22.23,35.88 R6.2 | 23.18,44.13 23.5,44.13 | 23.5,44.13 28.57,44.13 29.84,45.4 29.84,48.58 30.52,49.25 C1.2 | U1.3 16.36,74.76 19.05,72.07 19.05,63.5 16.51,60.96 16.51,57.47 15.85,56.81 9.21,56.81 | 9.21,56.81 8.89,56.81 | 8.89,56.81 8.67,56.81 | v15.24,49.85 17.78,49.85 23.18,44.45 | 23.18,44.45 23.5,44.13 | 23.18,44.45 23.18,44.13 | v8.89,55.56 8.89,56.4 8.89,56.59 | 8.89,56.59 8.89,56.81 | 8.9,56.5 9.21,56.81 | 8.89,56.59 8.67,56.81
  Bottom 0.305: v8.89,55.56 14.61,49.85 v15.24,49.85
GND  (via drill 0.35)
  Top 0.254: IC1.M 45.92,69.02 45.4,69.53 44.45,69.53 44.31,69.4 IC1.3
  Top 0.305: IC1.3 44.31,67.78 | 44.31,67.78 44.31,67.49 44.13,67.31 44.13,67.6 | 44.31,67.78 44.13,67.6 | IC1.EXP 43.81,67.28 44.13,67.6 | C7.1 49.88,74.02 v49.21,73.34 | v49.21,70.48 50.8,68.9 52.03,68.9 C6.1
  Bottom 0.305: S2.4 45,53.46 v48.38,56.83 | U$10.MSP 15.04,37.03 v15.24,37.03 | v33.34,45.72 33.34,46.99 35.56,49.21 v35.88,49.21 | S1.4 S1.3 | v49.21,73.34 v49.21,70.48 v53.98,65.72
  pour Top (isolate 0.305): 0.95,78.42 0.95,9.84 2.54,8.26 8.26,8.26 9.21,7.3 9.21,2.22 10.79,0.64 11.11,0.64 23.81,0.64 25.72,2.54 25.72,22.23 27.62,24.13 53.98,24.13 58.1,28.26 58.1,81.92 55.56,84.45 38.73,84.45 32.7,78.42 13.65,78.42 13.02,79.06 13.02,82.87 12.06,83.82 2.86,83.82 0.95,81.92
N$1  (via drill 0.35)
  Top 0.305: v30.8,50.16 25.6,50.16 v25.13,50.64 | v31.11,45.4 32.86,43.66 R2.1 | S1.2 21.39,53.46 v20.32,52.39
  Bottom 0.305: v31.11,45.4 31.11,49.85 v30.8,50.16 | v20.32,52.39 20.32,50.25 S1.1 | v25.13,50.64 23.61,52.15 S1.2
N$2  (via drill 0.35)
  Top 0.305: v31.91,42.7 31.23,43.38 25.69,43.38 25.2,42.89 25.2,42.2 25.34,42.06 25.34,37.95 25.2,37.81 25.2,37.12 25.34,36.98 25.34,34.23 25.08,33.97 R6.1
  Bottom 0.305: v31.91,42.7 35.4,42.7 36.95,44.25 S2.1 S2.2
N$3  (via drill 0.35)
  Top 0.61: U2.3 9.53,19.68 9.21,19.37 9.21,13.02 10.79,11.43 12.7,11.43 13.02,11.12 R17.2 U$8.MSP | v10.79,23.81 12.5,25.52 D2.C 21.15,25.52 22.86,23.81 C8.1
  Bottom 0.61: U2.3 v10.79,23.81
N$4  (via drill 0.35)
  Top 0.305: v18.1,36.2 v18.09,36.2
  Top 0.61: VR1.3 10.79,38.1 U$4.MSP R5.2 | v18.09,36.2 C2.1
  Bottom 0.305: 17.66,12.7 D1.C
  Bottom 0.61: v18.1,36.2 17.46,35.56 11.11,35.56 10.79,35.24 VR1.3 13.34,33.02 13.97,32.38 13.97,13.34 14.61,12.7 17.66,12.7
N$5
  Top 0.61: JP1.1 11.43,2.22 12.06,1.59 21.59,1.59 22.23,2.22 JP2.2
N$6  (via drill 0.35)
  Top 0.254: IC1.25 47.9,66.08 48.58,65.41 48.58,61.59 | 37.38,61.28 35.67,62.98
  Top 0.305: 48.58,61.59 48.26,61.28 43.81,61.28 | 43.81,61.28 37.38,61.28 | 35.67,62.98 35.67,71.91 U$6.MSP | 43.81,61.28 v42.86,62.23 | v41.59,58.74 41.59,57.78 40.96,57.15 39.69,57.15 38.42,55.88 v38.42,54.61 | R9.1 v23.81,37.47 | v36.51,32.07 36.51,34.49 v36.83,34.81
  Bottom 0.305: v42.86,62.23 42.23,62.23 41.59,61.59 v41.59,58.74 | v23.81,37.47 23.81,32.7 24.45,32.07 v36.51,32.07 | v36.83,34.81 36.95,34.92 47.31,34.92 48.26,35.88 48.26,48.58 47.31,49.53 39.37,49.53 38.42,50.48 v38.42,54.61
N$7
  Top 0.305: LED1.A 9.74,78.01 8.89,77.15 4.45,77.15 3.49,76.2 R10.1
N$8
  Top 0.305: R4.2 SV1.2
N$9  (via drill 0.35)
  Top 0.254: IC1.26 48.35,66.58 49.21,65.72 49.21,61.28 48.58,60.64 44.13,60.64 | 44.13,60.64 42.7,60.64 | 42.7,60.64 37.15,60.64 34.92,62.87 | 44.13,60.64 43.18,59.69 43.18,60.17 42.7,60.64
  Top 0.305: 43.18,59.69 v43.18,42.55 | v26.04,37.47 26.04,38.73 26.36,39.05 R8.1 | 34.92,62.87 34.92,73.7 U$7.MSP 36.2,76.83 34.69,78.34 13.98,78.34 13.34,78.98 13.34,81.92 13.06,82.19 LED1.C
  Bottom 0.305: v43.18,42.55 40.01,42.55 38.42,40.96 38.42,38.42 36.95,36.95 26.55,36.95 v26.04,37.47
N$10  (via drill 0.35)
  Top 0.254: IC1.7 42.31,69.44 v42.23,69.53
  Top 0.305: IC1.6 IC1.7 | R13.2 56.52,63.82 56.04,64.29 v54.93,64.29
  Bottom 0.305: v42.23,69.53 47.85,69.53 50.16,67.22 50.16,64.77 50.64,64.29 v54.93,64.29
N$11  (via drill 0.35)
  Top 0.254: IC1.8 37.2,67.58
  Top 0.305: R12.1 27.94,36.83 28.26,37.15 29.53,37.15 29.84,37.47 v29.84,37.78 | 37.2,67.58 v37.15,67.63
  Bottom 0.305: v37.15,67.63 29.84,60.33 v29.84,37.78
N$12  (via drill 0.35)
  Top 0.305: v39.37,44.45 39.37,38.51 36.74,35.88 R14.2 | v38.42,43.5 37.47,44.45 v35.88,44.45 | v30.8,42.55 v28.57,42.55 | v26.99,45.09 24.83,47.24 24.83,48.22 22.37,50.68 14.89,50.68 13.34,49.12 v13.34,48.9 | v8.26,50.8 8.26,51.44 7.89,51.8 T2.B
  Bottom 0.305: v39.37,44.45 v38.42,43.5 | v30.8,42.55 30.76,42.59 30.76,43.37 31.84,44.45 v35.88,44.45 | v28.57,42.55 26.99,44.13 v26.99,45.09 | v13.34,48.9 12.7,48.26 8.57,48.26 8.26,48.58 v8.26,50.8
N$13
  Top 0.305: R11.2 SV1.5
N$14
  Top 0.305: T1.B 4.66,49.21 9.68,49.21 10.16,49.69 R15.1
N$15
  Top 0.305: U1.2 12.53,76.03 11.43,74.93 11.43,74.94 R3.1
N$25  (via drill 0.35)
  Top 0.305: R34.2 45.68,55.6 v44.13,57.15 | v32.7,57.15 29.53,57.15 29.07,57.6 U1.24
  Bottom 0.305: v44.13,57.15 v32.7,57.15
PIN0  (via drill 0.35)
  Top 0.305: v35.24,55.24 35.56,55.56 35.56,59.85 34.62,60.79 U1.25 | v33.02,55.24 32.86,55.09 R16.2 34.25,53.7 34.61,53.34 34.61,43.18 35.56,42.23 R1.2 34.6,40.64 34.29,40.32 34.29,38.89 34.13,38.73 34.13,38.74 R2.2
  Bottom 0.305: v35.24,55.24 v33.02,55.24
PIN1
  Top 0.305: T1.C 11.39,48.22 14.64,51.48 28.64,51.48 28.96,51.8 R16.1
RTS  (via drill 0.35)
  Top 0.254: IC1.24 47.45,65.58 47.62,65.41 v47.62,64.45
  Top 0.305: v31.11,56.2 10.79,56.2 10.16,55.56 | 10.16,55.56 R15.2 | 10.16,55.56 8.29,53.7 T2.E
  Bottom 0.305: v47.62,64.45 47.62,57.47 46.35,56.2 v31.11,56.2
RXD  (via drill 0.35)
  Top 0.305: R9.2 v23.81,42.55 | U1.34 29.99,72.22 v29.84,72.07 | v27.3,69.85 v27.3,67.63 | v21.27,55.24 19.37,55.24 18.73,54.61 v18.73,52.7
  Bottom 0.305: v29.84,72.07 27.62,72.07 27.3,71.75 v27.3,69.85 | v27.3,67.63 21.27,61.59 v21.27,55.24 | v18.73,52.7 19.68,51.75 19.68,49.85 22.23,47.31 22.23,42.86 22.54,42.55 v23.81,42.55
SW  (via drill 0.35)
  Top 0.305: U$3.MSP R11.1 | R11.1 | v19.68,44.13 19.68,33.97 24.13,29.53 36.2,29.53 39.85,33.18 39.85,35.72 40.64,36.51 R11.1 | U1.8 16.52,68.41 16.83,68.1 v16.83,65.41
  Bottom 0.305: v16.83,65.41 16.83,46.99 v19.68,44.13
TXD  (via drill 0.35)
  Top 0.305: U1.35 29.68,73.49 28.57,72.39 v28.57,62.23 | v26.04,42.55 27.3,42.55 27.94,41.91 R8.2
  Bottom 0.305: v28.57,62.23 26.04,59.69 v26.04,42.55
VBUS  (via drill 0.35)
  Top 0.305: J1.1 45.41,73.97 47.31,72.07 52.03,72.07 C7.2 | C7.2 55.77,72.11 R18.1 | C7.2 52.07,70.8 52.39,70.48 53.02,70.48 53.82,69.69 53.82,67.47 53.38,67.03 C6.2
  Top 0.406: R12.2 29.21,33.98 30.33,35.1 30.33,36.89 30.91,37.47 v30.91,37.78 | v39.69,48.58 39.69,54.48 v40.57,55.36 | v44.45,55.24 45.72,53.98 v50.05,53.98 | v50.16,63.18 50.16,63.5 52.07,65.41 C6.2
  Bottom 0.406: v39.69,48.58 39.69,46.06 35.36,41.73 34.85,41.73 v30.91,37.78 | v40.57,55.36 40.82,55.36 40.95,55.49 44.21,55.49 v44.45,55.24 | v50.05,53.98 50.16,54.09 v50.16,63.18
VCC
  Top 0.305: 10.96,9.37 R17.1
  Top 0.61: 10.96,9.37 3.09,9.37 1.91,10.55 1.91,38.73 3.17,40.01 R5.1 | JP2.1 16.51,6.99 12.06,6.99 11.12,7.93 R17.1
VRX
  Top 0.305: U1.6 8.04,70.95 U$2.MSP
  Bottom 0.305: U$2.MSP 5.71,68.62 5.71,60.33 5.71,44.77 8.57,41.91 20,41.91 22.23,39.69 22.23,32.7 23.5,31.43 35.24,31.43 39.69,26.99 45.72,26.99 46.99,28.26 SV1.3
VRY  (via drill 0.35)
  Top 0.305: U$1.MSP 7.66,67.31 9.53,67.31 10.16,67.94 10.16,68.9 10.94,69.68 U1.7 17,69.68 18.1,68.58 v18.1,65.41
  Bottom 0.305: SV1.4 44.45,31.75 43.06,33.14 29.18,33.14 25.2,37.12 25.2,49.38 18.1,56.49 v18.1,65.41

### Text on the board
tValues: + | - | - | +